# EAGLE design MB006-A (EAGLE 5.07)
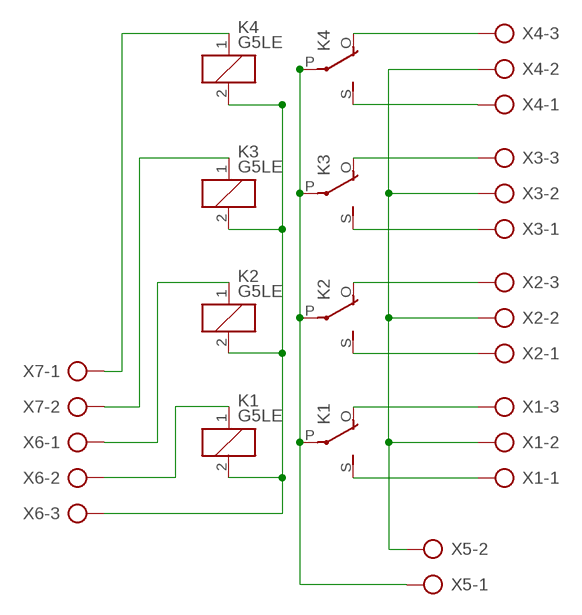
[diagram p0: schematic, sheet 1]

## Parts
K1  G5LE  [G5LE]
K2  G5LE  [G5LE]
K3  G5LE  [G5LE]
K4  G5LE  [G5LE]
X1  AK500/3  [AK500/3]
X2  AK500/3  [AK500/3]
X3  AK500/3  [AK500/3]
X4  AK500/3  [AK500/3]
X5  AK500/2  [AK500/2]
X6  AK500/3  [AK500/3]
X7  AK500/2  [AK500/2]

## Nets
N$1: K1.P(2:P) K2.P(2:P) K3.P(2:P) K4.P(2:P) X5.1
N$2: K1.2 K2.2 K3.2 K4.2 X6.3
N$3: K1.1 X6.2
N$4: K2.1 X6.1
N$5: K3.1 X7.2
N$6: K4.1 X7.1
N$7: K4.S(2:S) X4.1
N$8: K4.O(2:O) X4.3
N$9: K3.O(2:O) X3.3
N$10: K3.S(2:S) X3.1
N$11: K2.O(2:O) X2.3
N$12: K2.S(2:S) X2.1
N$13: K1.O(2:O) X1.3
N$14: K1.S(2:S) X1.1
N$15: X1.2 X2.2 X3.2 X4.2 X5.2

## Library data of the parts
K1-K4 = relay:G5LE: RELAY 1 x switch, 10 A/120 V AC, 8 A/30 V DC, Omron
X1-X4 X6 = con-ptr500:AK500/3: CONNECTOR
X5 X7 = con-ptr500:AK500/2: CONNECTOR

## Board
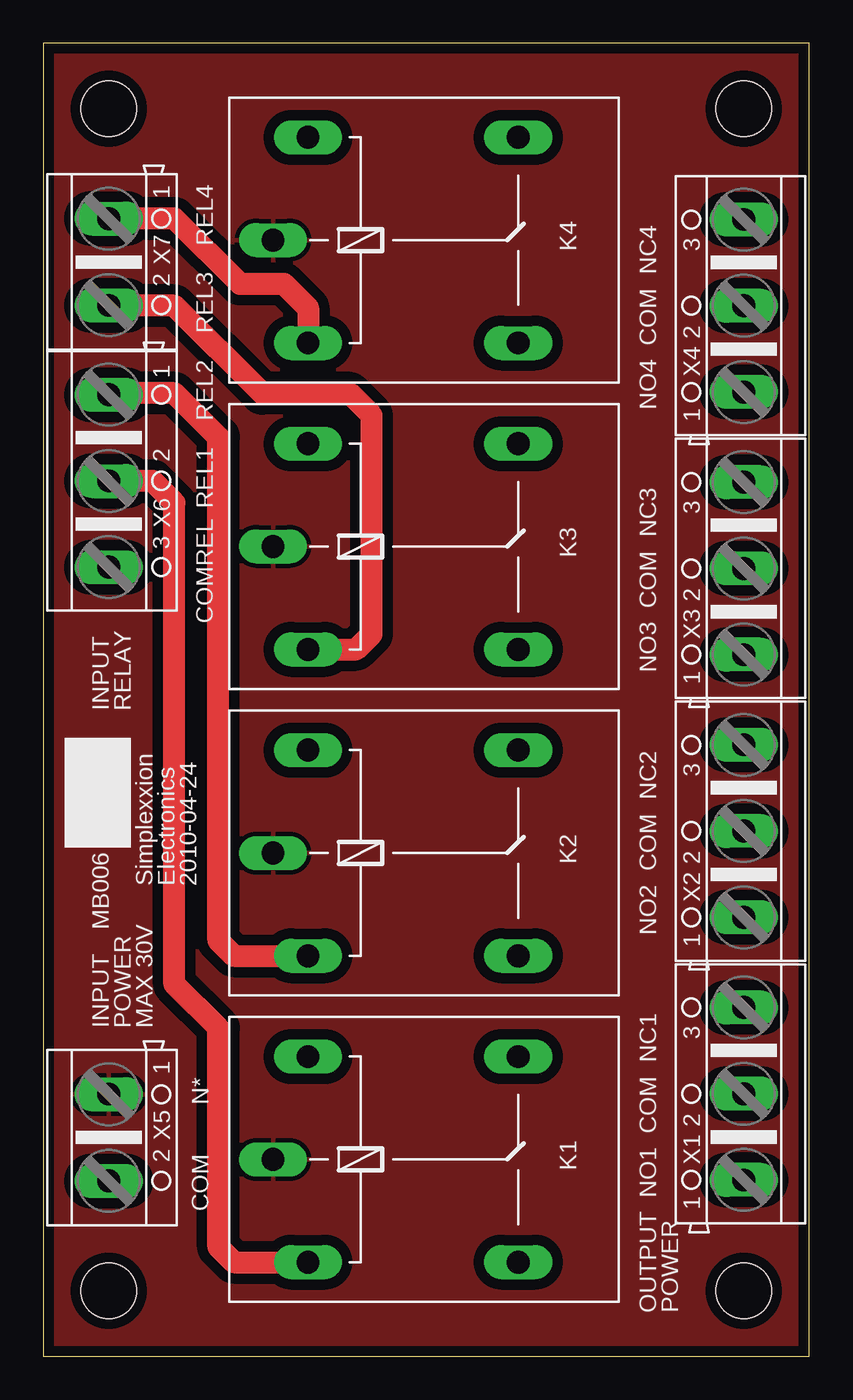
[diagram p1: board, top side]
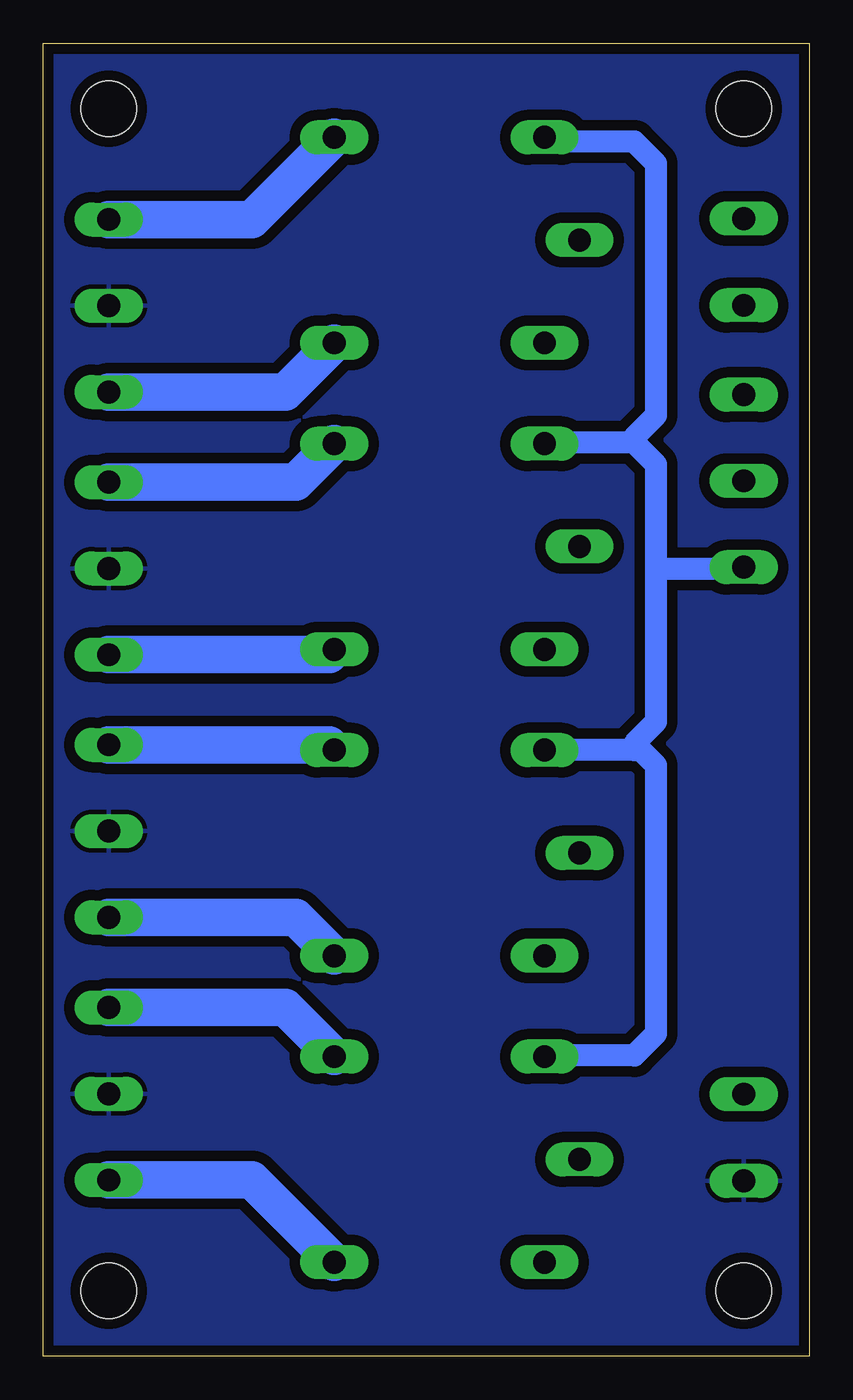
[diagram p2: board, bottom side, seen from below]

Size 44.45 x 76.2 mm. Coordinates in mm from the lower left corner, seen from the top.
Outline: 0,0 44.45,0 44.45,76.2 0,76.19 0,0
Copper layers (1*16): Top 0.035mm / dielectric 1.5mm / Bottom 0.035mm
Design rules "makepcb.com": minimum track width 0.2mm, minimum drill 0.3mm, track to track 0.2mm, track to pad 0.2mm, pad to pad 0.2mm, via to via 0.2mm, smd to smd 0.2mm, copper to edge 0.2mm, drill to drill 8mil, minimum pad ring 10mil, minimum via ring 8mil, stop-mask expansion 4mil, vias tented up to drill 0mil, thermal gap 10mil
Holes 3.2 mm at 3.81,72.39 40.64,72.39 40.64,3.81 3.81,3.81

### Footprints (pad centres in the part's own frame; a part is rotated, then mirrored left to right if it is on the bottom)
G5LE = drill 1.321 long: 1 -7.493,-5.969; 2 -7.493,5.969; O 4.699,5.969; P -9.525,0; S 4.699,-5.969
AK500/3 = drill 1.321 long: 1 -5.004,0; 2 0,0; 3 5.004,0
AK500/2 = drill 1.321 long: 1 -2.515,0; 2 2.515,0

### Placement (x,y rotation side)
K1  22.86,11.43 0 top
K2  22.86,29.21 0 top
K3  22.86,46.99 0 top
K4  22.86,64.77 0 top
X1  40.64,15.24 90 top
X2  40.64,30.48 90 top
X3  40.64,45.72 90 top
X4  40.64,60.96 90 top
X5  3.81,12.7 270 top
X6  3.81,50.8 270 top
X7  3.81,63.5 270 top

### Tracks (layer width: path | path; a pad name or v marks a point on that pad's centre or on a via)
N$1
  pour Top (isolate 0.61): 0,76.2 44.45,76.2 44.45,0 0,0
N$2
  Bottom 1.27: 10.16,35.18 9.78,35.18 8.89,34.29 8.89,18.73 10.16,17.46 15.3,17.46 K1.2 | 10.16,35.18 K2.2 | K3.2 15.3,53.02 10.16,53.02 | 10.16,53.02 8.89,51.75 8.89,45.72 | 8.89,45.72 8.89,36.83 10.16,35.56 10.16,35.18 | K4.2 15.11,70.48 10.16,70.48 8.89,69.22 8.89,54.61 10.16,53.34 10.16,53.02 | X6.3 3.89,45.72 8.89,45.72
N$3
  Top 1.27: X6.2 6.35,50.8 7.62,49.53 7.62,21.59 10.16,19.05 10.16,6.35 11.05,5.46 K1.1
N$4
  Top 1.27: X6.1 3.89,55.88 7.62,55.88 10.16,53.34 10.16,24.13 11.05,23.24 K2.1
N$5
  Top 1.27: X7.2 3.83,60.96 7.62,60.96 12.7,55.88 17.78,55.88 19.05,54.61 19.05,41.91 18.16,41.02 K3.1
N$6
  Top 1.27: X7.1 3.83,66.04 7.62,66.04 11.43,62.23 13.97,62.23 15.37,60.83 K4.1
N$7
  Bottom 2.184: K4.S 30.4,55.96 X4.1
N$8
  Bottom 2.184: K4.O 32.33,65.96 X4.3
N$9
  Bottom 2.184: K3.O 29.79,50.72 X3.3
N$10
  Bottom 1.27: K3.S 27.86,40.72
  Bottom 2.184: 27.86,40.72 X3.1
N$11
  Bottom 1.27: K2.O 27.86,35.48
  Bottom 2.184: 27.86,35.48 X2.3
N$12
  Bottom 2.184: K2.S 29.79,25.48 X2.1
N$13
  Bottom 2.184: K1.O 30.4,20.24 X1.3
N$14
  Bottom 2.184: K1.S 32.33,10.24 X1.1
N$15
  pour Bottom (isolate 0.61): 0,76.2 44.45,76.2 44.45,0 0,0

### Text on the board
tNames: REL4 | REL3 | NO4 COM NC4 | REL2 | REL1 | COMREL | NO3 COM NC3 | INPUT | RELAY | Simplexxion | Electronics | 2010-04-24 | MB006 | NO2 COM NC2 | INPUT | POWER | MAX 30V | N* | COM | NO1 COM NC1 | OUTPUT | POWER
bStop: Simplexxion Electronics